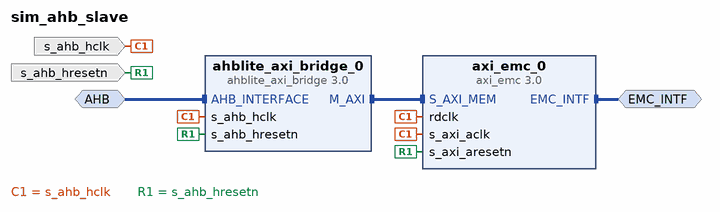
[diagram p0: block diagram of the top level]
# Vivado block design sim_ahb_slave, xc7a200tfbg676-2, Vivado 2017.1
create_bd_design sim_ahb_slave

create_bd_intf_port -mode Slave -vlnv xilinx.com:interface:ahblite_rtl:2.0 AHB
create_bd_intf_port -mode Master -vlnv xilinx.com:interface:emc_rtl:1.0 EMC_INTF
create_bd_port -dir I -type clk s_ahb_hclk
create_bd_port -dir I -type rst s_ahb_hresetn

create_bd_cell -type ip -vlnv xilinx.com:ip:ahblite_axi_bridge:3.0 ahblite_axi_bridge_0
set_property -dict {CONFIG.C_M_AXI_SUPPORTS_NARROW_BURST 1} [get_bd_cells ahblite_axi_bridge_0]
create_bd_cell -type ip -vlnv xilinx.com:ip:axi_emc:3.0 axi_emc_0
set_property -dict [list \
  CONFIG.C_TWPH_PS_MEM_0 15000 \
  CONFIG.C_TWP_PS_MEM_0 15000 \
  CONFIG.C_THZOE_PS_MEM_0 5000 \
  CONFIG.C_THZCE_PS_MEM_0 5000 \
  CONFIG.C_TPACC_PS_FLASH_0 15000 \
  CONFIG.C_TAVDV_PS_MEM_0 10000 \
  CONFIG.C_TCEDV_PS_MEM_0 10000 \
  CONFIG.C_MEM0_TYPE 1 \
  CONFIG.C_S_AXI_EN_REG 0 \
] [get_bd_cells axi_emc_0]

# ---- connections ----

connect_bd_intf_net [get_bd_intf_pins ahblite_axi_bridge_0/M_AXI] [get_bd_intf_pins axi_emc_0/S_AXI_MEM]
connect_bd_intf_net [get_bd_intf_ports AHB] [get_bd_intf_pins ahblite_axi_bridge_0/AHB_INTERFACE]
connect_bd_intf_net [get_bd_intf_ports EMC_INTF] [get_bd_intf_pins axi_emc_0/EMC_INTF]
connect_bd_net [get_bd_ports s_ahb_hclk] \
  [get_bd_pins ahblite_axi_bridge_0/s_ahb_hclk] [get_bd_pins axi_emc_0/s_axi_aclk] [get_bd_pins axi_emc_0/rdclk]
connect_bd_net [get_bd_ports s_ahb_hresetn] [get_bd_pins ahblite_axi_bridge_0/s_ahb_hresetn] [get_bd_pins axi_emc_0/s_axi_aresetn]

# ---- address map ----
assign_bd_address -offset 0x00000000 -range 8K -target_address_space [get_bd_addr_spaces AHB] [get_bd_addr_segs axi_emc_0/S_AXI_MEM/MEM0]

validate_bd_design
save_bd_design
